# Altium schematic sheet [05] - HW_STATION_NODE.SchDoc
size A3; SheetNumber: 6; SheetTotal: 8
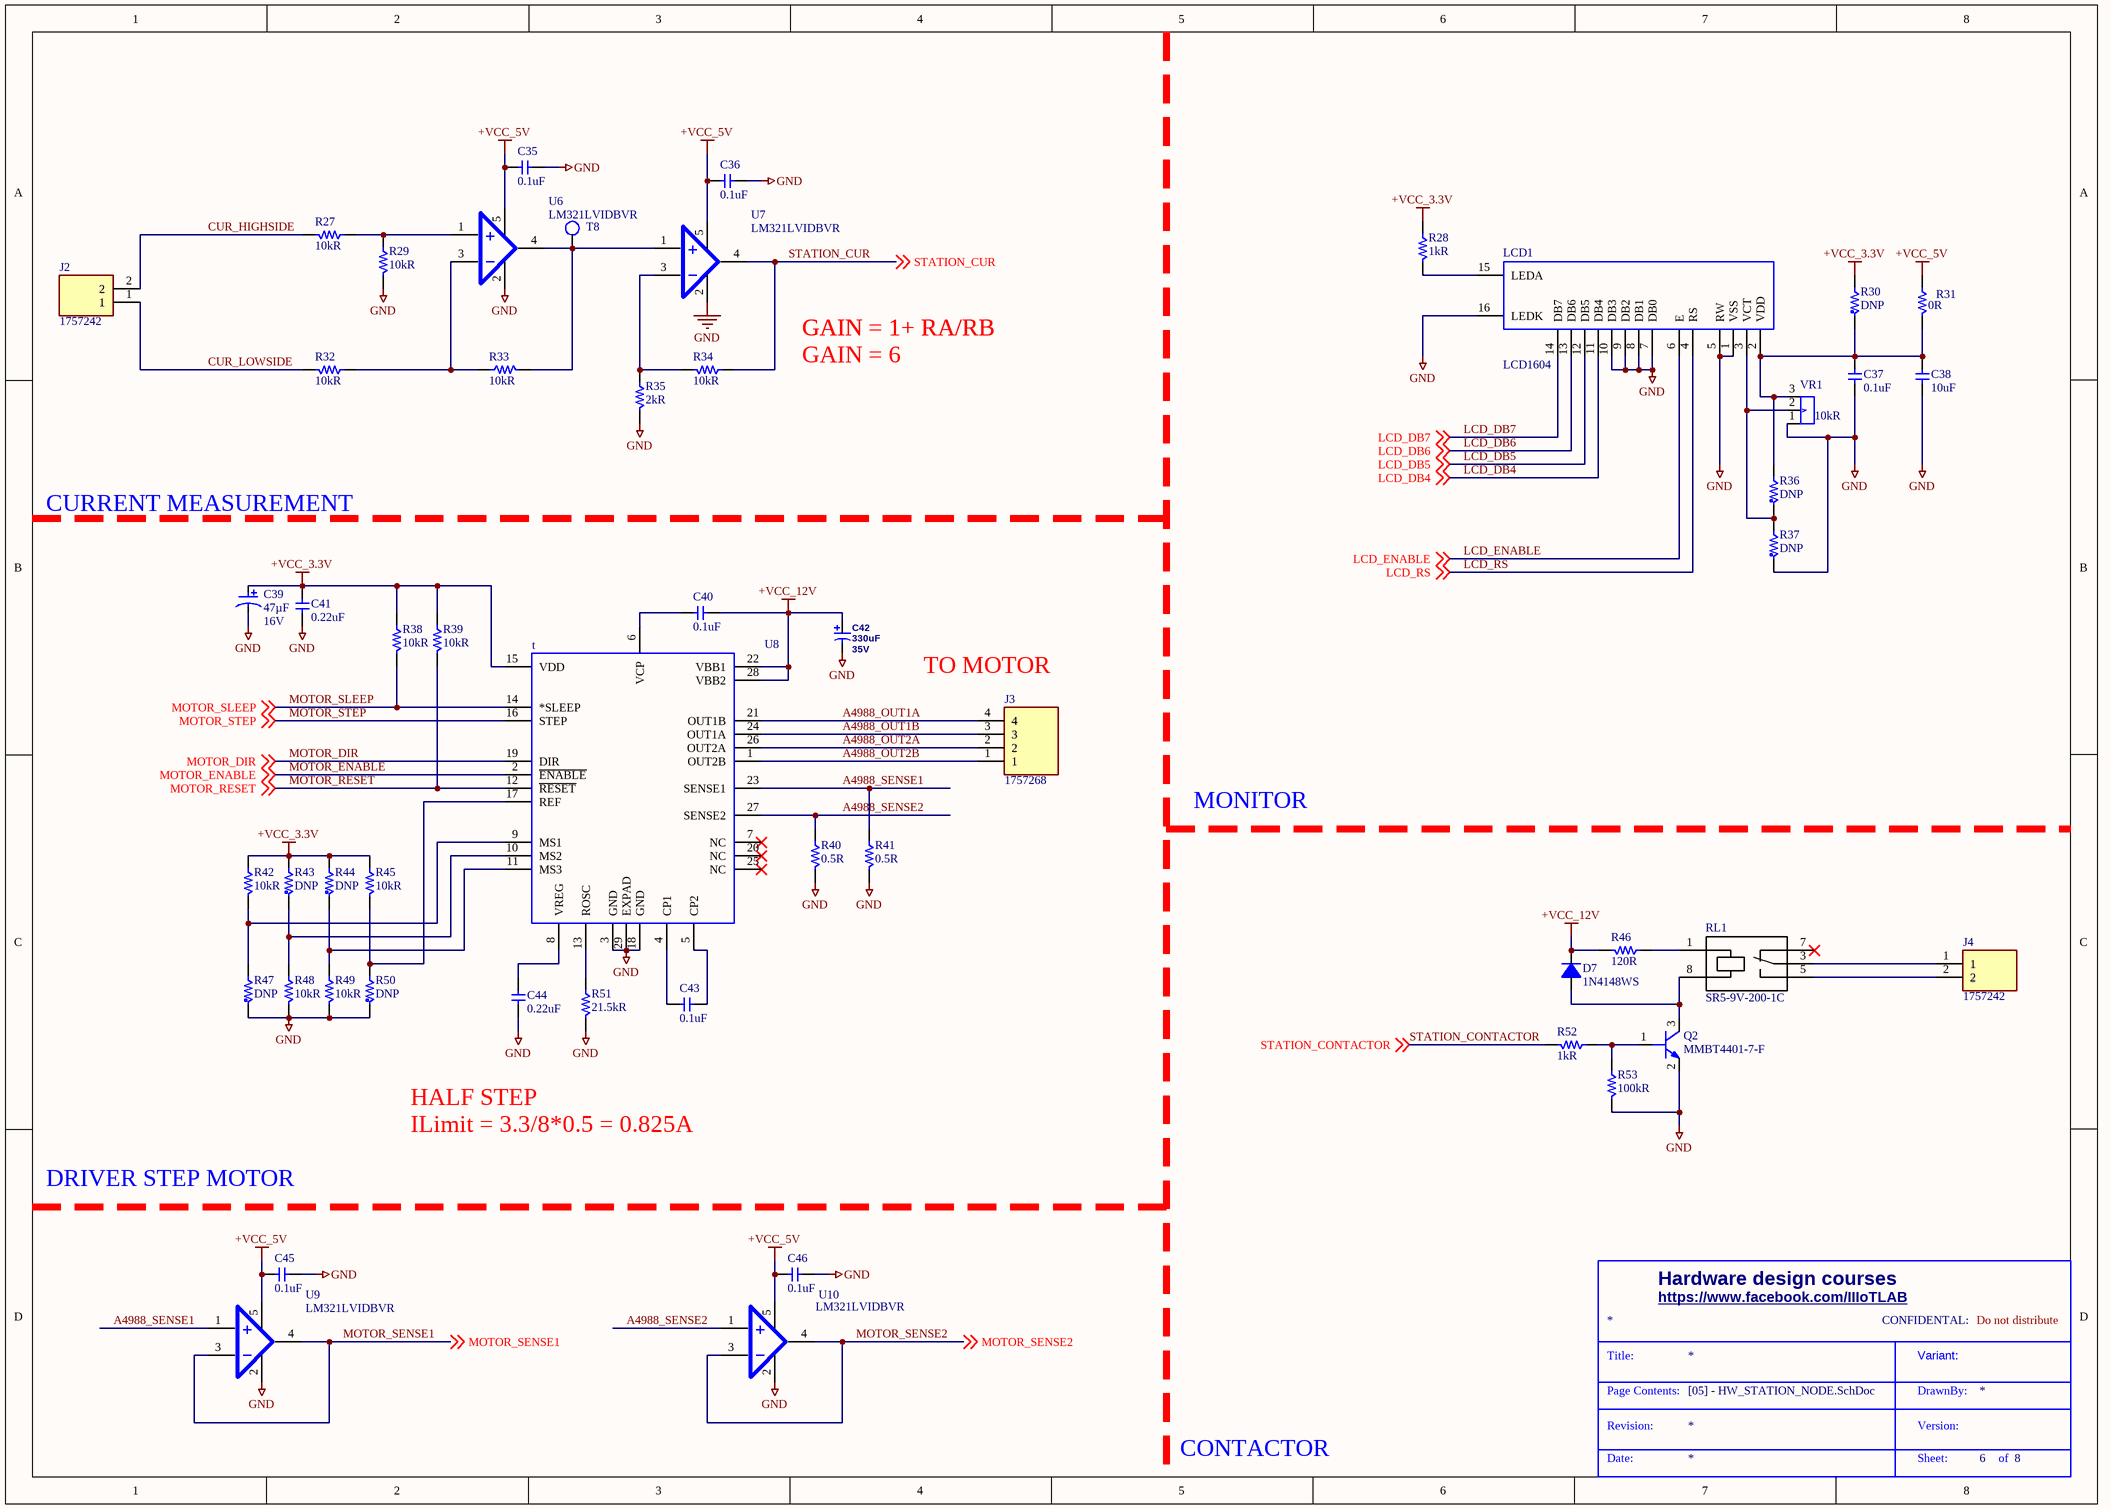
[diagram p0: [05] - HW_STATION_NODE.SchDoc]

## Parts
C35  0.1uF  [CAP 0402 (1005)]
C36  0.1uF  [CAP 0402 (1005)]
C37  0.1uF  [CAP 0402 (1005)]
C38  10uF  [CAP 0603 (1608)]
C39  Capacitance: 47µF  Voltage - Rated: 16V  [CAP TANTA 2312]  (hidden comment: TAJC476M016RNJ)
C40  0.1uF  [CAP 0402 (1005)]
C41  0.22uF  [CAP 0402 (1005)]
C42  330uF  Voltage Rating: 35V  [P-CAPAE116103X125M]
C43  0.1uF  [CAP 0402 (1005)]
C44  0.22uF  [CAP 0402 (1005)]
C45  0.1uF  [CAP 0402 (1005)]
C46  0.1uF  [CAP 0402 (1005)]
D7  1N4148WS  [SOD323]
J2  1757242  [1757242]
J3  1757268  [1757268]
J4  1757242  [1757242]
LCD1  LCD1604  [LCD 1604]
Q2  MMBT4401-7-F  [SOT-23-3]
R27  10kR  [RES 0402 (1005)]
R28  1kR  [RES 0402 (1005)]
R29  10kR  [RES 0402 (1005)]
R30  DNP  [RES 0603 (1608)]
R31  0R  [RES 0603 (1608)]
R32  10kR  [RES 0402 (1005)]
R33  10kR  [RES 0402 (1005)]
R34  10kR  [RES 0402 (1005)]
R35  2kR  [RES 0402 (1005)]
R36  DNP  [RES 0402 (1005)]
R37  DNP  [RES 0402 (1005)]
R38  10kR  [RES 0402 (1005)]
R39  10kR  [RES 0402 (1005)]
R40  0.5R  [RES 2512]
R41  0.5R  [RES 2512]
R42  10kR  [RES 0402 (1005)]
R43  DNP  [RES 0402 (1005)]
R44  DNP  [RES 0402 (1005)]
R45  10kR  [RES 0402 (1005)]
R46  120R  [RES 0603 (1608)]
R47  DNP  [RES 0402 (1005)]
R48  10kR  [RES 0402 (1005)]
R49  10kR  [RES 0402 (1005)]
R50  DNP  [RES 0402 (1005)]
R51  21.5kR  [RES 0402 (1005)]
R52  1kR  [RES 0402 (1005)]
R53  100kR  [RES 0402 (1005)]
RL1  SR5-9V-200-1C  [RELAY SR5-9V-200-1C]
T8  TEST_POINT  [TEST POINT]  (value not drawn)
U6  LM321LVIDBVR  [SOT-23-5]
U7  LM321LVIDBVR  [SOT-23-5]
U8  t  [28-VFQFN Exposed Pad]
U9  LM321LVIDBVR  [SOT-23-5]
U10  LM321LVIDBVR  [SOT-23-5]
VR1  10kR  [3296W-1]

## Nets
+VCC_3.3V: C39.2(+) C41.1 R28.2 R30.2 R38.2 R39.2 R42.2 R43.2 R44.2 R45.2 U8.15(VDD)
+VCC_5V: C35.2 C36.2 C45.2 C46.2 R31.2 U6.5 U7.5 U9.5 U10.5
+VCC_12V: C40.1 C42.1(+) D7.1(K) R46.1 U8.22(VBB1) U8.28(VBB2)
GND: C35.1 C36.1 C37.2 C38.2 C39.1(-) C41.2 C42.2(-) C44.2 C45.1 C46.1 LCD1.1(VSS) LCD1.5(RW) LCD1.7(DB0) LCD1.8(DB1) LCD1.9(DB2) LCD1.10(DB3) LCD1.16(LEDK) Q2.2(E) R29.1 R35.1 R37.1 R40.1 R41.1 R47.1 R48.1 R49.1 R50.1 R51.1 R53.1 U6.2 U7.2 U8.3(GND) U8.18(GND) U8.29(EXPAD) U9.2 U10.2 VR1.1(CCW)
A4988_OUT1A: J3.4 U8.21(OUT1B)
A4988_OUT1B: J3.3 U8.24(OUT1A)
A4988_OUT2A: J3.2 U8.26(OUT2A)
A4988_OUT2B: J3.1 U8.1(OUT2B)
A4988_SENSE1: R41.2 U8.23(SENSE1) U9.1
A4988_SENSE2: R40.2 U8.27(SENSE2) U10.1
CUR_HIGHSIDE: J2.2 R27.1
CUR_LOWSIDE: J2.1 R32.1
LCD_DB4: LCD1.11(DB4) ; off-sheet LCD_DB4
LCD_DB5: LCD1.12(DB5) ; off-sheet LCD_DB5
LCD_DB6: LCD1.13(DB6) ; off-sheet LCD_DB6
LCD_DB7: LCD1.14(DB7) ; off-sheet LCD_DB7
LCD_ENABLE: LCD1.6(E) ; off-sheet LCD_ENABLE
LCD_RS: LCD1.4(RS) ; off-sheet LCD_RS
MOTOR_DIR: U8.19(DIR) ; off-sheet MOTOR_DIR
MOTOR_ENABLE: U8.2(~{ENABLE}) ; off-sheet MOTOR_ENABLE
MOTOR_RESET: R39.1 U8.12(~{RESET}) ; off-sheet MOTOR_RESET
MOTOR_SENSE1: U9.3 U9.4 ; off-sheet MOTOR_SENSE1
MOTOR_SENSE2: U10.3 U10.4 ; off-sheet MOTOR_SENSE2
MOTOR_SLEEP: R38.1 U8.14(*SLEEP) ; off-sheet MOTOR_SLEEP
MOTOR_STEP: U8.16(STEP) ; off-sheet MOTOR_STEP
STATION_CONTACTOR: R52.1 ; off-sheet STATION_CONTACTOR
STATION_CUR: R34.2 U7.4 ; off-sheet STATION_CUR
NetC37_1: C37.1 C38.1 LCD1.2(VDD) R30.1 R31.1 R36.2 VR1.3(CW)
NetC40_2: C40.2 U8.6(VCP)
NetC43_1: C43.1 U8.5(CP2)
NetC43_2: C43.2 U8.4(CP1)
NetC44_1: C44.1 U8.8(VREG)
NetD7_2: D7.2(A) Q2.3(C) RL1.8(C2)
NetJ4_1: J4.1 RL1.3(C)
NetJ4_2: J4.2 RL1.5(NO)
NetLCD1_3: LCD1.3(VCT) R36.1 R37.2 VR1.2(WIPER)
NetLCD1_15: LCD1.15(LEDA) R28.1
NetQ2_1: Q2.1(B) R52.2 R53.2
NetR27_2: R27.2 R29.2 U6.1
NetR32_2: R32.2 R33.2 U6.3
NetR33_1: R33.1 T8.1 U6.4 U7.1
NetR34_1: R34.1 R35.2 U7.3
NetR42_1: R42.1 R47.2 U8.9(MS1)
NetR43_1: R43.1 R48.2 U8.10(MS2)
NetR44_1: R44.1 R49.2 U8.11(MS3)
NetR45_1: R45.1 R50.2 U8.17(REF)
NetR46_2: R46.2 RL1.1(C1)
NetR51_2: R51.2 U8.13(ROSC)

Not connected (* = marked no-connect by the designer): RL1 7(NC)*; U8 7(NC)* 20(NC)* 25(NC)*

## Notes on the sheet
- GAIN = 1+ RA/RB
- GAIN = 6
- CURRENT MEASUREMENT
- (near J3) TO MOTOR
- MONITOR
- HALF STEP
- DRIVER STEP MOTOR
- ILimit = 3.3/8*0.5 = 0.825A
- Hardware design courses
- https://www.facebook.com/IIIoTLAB
- CONFIDENTAL:
- Do not distribute
- Title:
- Page Contents:
- Variant:
- DrawnBy:
- CONTACTOR
- Revision:
- Date:
- Sheet:
- Version:
- of

## Library data of the parts
C35-C37 C40 C43 C45 C46 = CAP0402 0.1uF 50V: 50V 100nF ±10% 0402 Multilayer Ceramic Capacitors MLCC - SMD/SMT ROHS; Manufacturer: Samwha Capacitor; Manufacturer Part Number: CS1005X7R104K500NR; Supplier: LCSC electronics; Unit Price: $0.0017
C38 = CAP0603 10uF 25V: 25V 10uF X5R ±20% 0603 Multilayer Ceramic Capacitors MLCC - SMD/SMT ROHS; Manufacturer: Chinocera; Manufacturer Part Number: HGC0603R5106M250NTHJ; Supplier: LCSC electronics; Unit Price: $0.0199
C39 = CAP TANTA 47UF 16V 2312 20%: Manufacturer: AVX Corporation; Manufacturer Size Code: C; Type: Molded; ESR (Equivalent Series Resistance): 500 mOhm; Supplier 1: Digi-Key; Supplier Part Number 1: 478-3912-1-ND; Manufacturer Part Number: TAJC476M016RNJ; RoHS: RoHS Compliant; Category: Capacitors; Stock 1: 1330; Pricing 1: 1=0.96, 10=0.728, 25=0.644, 50=0.6048, 100=0.5208, 250=0.4704 (USD); Packaging: Cut Tape (CT); Part Status: Active; Tolerance: ±20%; Operating Temperature: -55°C ~ 125°C; Lifetime @ Temp.: -; Mounting Type: Surface Mount; Package / Case: 2312 (6032 Metric); Size / Dimension: 0.236" L x 0.126" W (6.00mm x 3.20mm); Height - Seated (Max): 0.110" (2.80mm); Lead Spacing: -; Features: General Purpose; Failure Rate: -; ComponentLink1URL: http://datasheets.avx.com/TAJ.pdf; ComponentLink1Description: http://datasheets.avx.com/TAJ.pdf
C41 C44 = CAP0402 0.22uF 35V: 35V 0.22uF X5R ±10% 0402 Multilayer Ceramic Capacitors MLCC - SMD/SMT ROHS; Manufacturer: Murata Electronics; Manufacturer Part Number: GRT155R6YA224KE01D; Supplier: LCSC electronics; Unit Price: US$ 0.0130
C42 = CAP ALUM 330uF 35V: CAP ALUM 330UF 20% 35V SMD; Manufacturer: Panasonic Electronic Components; Manufacturer Part Number: EEE-HA1V331P; Capacitance: 330µF; Lifetime @ Temp.: 1000 Hrs @ 105°C; Polarization: Polar; Ripple Current - Low Frequency: 250mA @ 120Hz; Ripple Current - High Frequency: 425mA @ 10kHz; Surface Mount Land Size: 0.406" L x 0.406" W (10.30mm x 10.30mm); Supplier 1: Digi-Key; RoHS: RoHS Compliant; Category: Capacitors; Stock 1: 134724; Pricing 1: 1=0.66, 10=0.486, 100=0.3336 (USD); Packaging: Cut Tape (CT); Part Status: Active; Tolerance: ±20%; ESR (Equivalent Series Resistance): -; Operating Temperature: -40°C ~ 105°C; Applications: Automotive; Impedance: -; Lead Spacing: -; Size / Dimension: 0.394" Dia (10.00mm); Height - Seated (Max): 0.402" (10.20mm); Mounting Type: Surface Mount; Package / Case: Radial, Can - SMD; ComponentLink1URL: https://industrial.panasonic.com/cdbs/www-data/pdf/RDE0000/ABA0000C1151.pdf; ComponentLink1Description: https://industrial.panasonic.com/cdbs/www-data/pdf/RDE0000/ABA0000C1151.pdf; Supplier Part Number 1: PCE4245CT-ND
D7 = DIO 1N4148WS: DIODE GEN PURP 75V 150MA SOD323F; Manufacturer: Fairchild/ON Semiconductor; Diode Type: Standard; Voltage - Forward (Vf) (Max) @ If: 1V @ 10mA; Speed: Small Signal =< 200mA (Io), Any Speed; Current - Reverse Leakage @ Vr: 5µA @ 75V; Capacitance @ Vr, F: 4pF @ 0V, 1MHz; Supplier 1: Digi-Key; Manufacturer Part Number: 1N4148WS; RoHS: RoHS Compliant; Category: Discrete Semiconductor Products; Stock 1: 318953; Pricing 1: 1=0.18, 10=0.168, 100=0.0912, 500=0.05614, 1000=0.03827 (USD); Packaging: Cut Tape (CT); Part Status: Active; Current - Average Rectified (Io): 150mA; Mounting Type: Surface Mount; Package / Case: SC-90, SOD-323F; Supplier Device Package: SOD-323F; Operating Temperature - Junction: 150°C (Max); ComponentLink1URL: https://www.fairchildsemi.com/datasheets/1N/1N4148WS.pdf; ComponentLink1Description: https://www.fairchildsemi.com/datasheets/1N/1N4148WS.pdf; Supplier Part Number 1: 1N4148WSFSCT-ND
J2 J4 = 1757242: Connector; Manufacturer_Name: Phoenix Contact; Datasheet Link: http://www.phoenixcontact.com/de/produkte/1757242/pdf; Height: 8.72mm; Manufacturer_Part_Number: 1757242; Mouser Part Number: 651-1757242; Mouser Price/Stock: https://www.mouser.co.uk/ProductDetail/Phoenix-Contact/1757242?qs=uD%2FdkN7XIa3Ejiz9qDxlzw%3D%3D; Arrow Part Number: 1757242; Arrow Price/Stock: https://www.arrow.com/en/products/1757242/phoenix-contact?region=nac
J3 = 1757268: Connector; Manufacturer_Name: Phoenix Contact; Datasheet Link: http://www.phoenixcontact.com/de/produkte/1757268/pdf; Height: 8.72mm; Manufacturer_Part_Number: 1757268; Mouser Part Number: 651-1757268; Mouser Price/Stock: https://www.mouser.co.uk/ProductDetail/Phoenix-Contact/1757268?qs=uD%2FdkN7XIa2BicmSj3mD7g%3D%3D; Arrow Part Number: 1757268; Arrow Price/Stock: https://www.arrow.com/en/products/1757268/phoenix-contact?region=nac
LCD1 = LCD 1604
Q2 = TRANS MMBT4401-7-F: TRANS NPN 40V 0.6A SMD SOT23-3; Manufacturer: Diodes Incorporated; Vce Saturation (Max) @ Ib, Ic: 750mV @ 50mA, 500mA; DC Current Gain (hFE) (Min) @ Ic, Vce: 100 @ 150mA, 1V; Frequency - Transition: 250MHz; Supplier 1: Digi-Key; Manufacturer Part Number: MMBT4401-7-F; RoHS: RoHS Compliant; Category: Discrete Semiconductor Products; Stock 1: 86548; Pricing 1: 1=0.15, 10=0.134, 100=0.0729, 500=0.04486, 1000=0.03059 (USD); Packaging: Cut Tape (CT); Part Status: Active; Transistor Type: NPN; Current - Collector Cutoff (Max): -; Operating Temperature: -55°C ~ 150°C (TJ); Mounting Type: Surface Mount; Package / Case: TO-236-3, SC-59, SOT-23-3; Supplier Device Package: SOT-23-3; ComponentLink1URL: https://www.diodes.com/assets/Datasheets/ds30039.pdf; ComponentLink1Description: https://www.diodes.com/assets/Datasheets/ds30039.pdf; Supplier Part Number 1: MMBT4401-FDICT-ND
R27 R29 R32-R34 R38 R39 R42 R45 R48 R49 = RES0402 10kR 1%: ±1% 10kΩ 0402 Chip Resistor - Surface Mount ROHS; Manufacturer: VO; Manufacturer Part Number: SCR0402F10K; Supplier: LCSC electronics; Unit Price: $0.0005
R28 R52 = RES0402 1kR 1%: ±5% 1kΩ 0402 Chip Resistor - Surface Mount ROHS; Manufacturer: VO; Manufacturer Part Number: SCR0402J1K; Supplier: LCSC electronics; Unit Price: $0.0004
R30 = RES0603 DNP: Res do not populate
R31 = RES0603 0R: 0Ω 0603 Chip Resistor - Surface Mount ROHS; Manufacturer: KOA Speer Elec; Manufacturer Part Number: RK73Z1JTTD; Supplier: LCSC electronics; Unit Price: $0.0048
R35 = RES0402 2kR 1%: ±1% 2kΩ 0402 Chip Resistor - Surface Mount ROHS; Manufacturer: VO; Manufacturer Part Number: SCR0402F2K; Supplier: LCSC electronics; Unit Price: $0.0005
R36 R37 R43 R44 R47 R50 = RES0402 DNP: Res do not populate
R40 R41 = R2512 0.5R 1% 2W: RES 0.5 OHM 1% 2W 2512; Manufacturer: Stackpole Electronics; Manufacturer Part Number: CSR2512FTR500; Categories: Resistors; Resistance: 500 mOhms; Temperature Coefficient: ±200ppm/°C; Supplier 1: Digi-Key; Stock 1: 61575; Pricing 1: 1=0.55, 10=0.418, 25=0.318, 50=0.2364, 100=0.1757, 250=0.1485, 500=0.1273, 1000=0.097 (USD); Series: CSR; Packaging: Tape & Reel (TR); Part Status: Active; Tolerance: ±1%; Power (Watts): 2W; Composition: Thick Film; Features: Current Sense; Operating Temperature: -55°C ~ 155°C; Package / Case: 2512 (6432 Metric); Supplier Device Package: 2512; Size / Dimension: 0.252 L x 0.126 W (6.40mm x 3.20mm); Height - Seated (Max): 0.026 (0.65mm); Number of Terminations: 2; Failure Rate: -; ComponentLink1URL: https://www.seielect.com/Catalog/SEI-CSR_CSRN.pdf?src-supplier=Avnet; ComponentLink1Description: https://www.seielect.com/Catalog/SEI-CSR_CSRN.pdf?src-supplier=Avnet; ComponentLink2URL: http://www.seielect.com/Catalog/SEI-csr.pdf?src-supplier=Future+Electronics; ComponentLink2Description: http://www.seielect.com/Catalog/SEI-csr.pdf?src-supplier=Future+Electronics; ComponentLink3URL: https://www.seielect.com/catalog/SEI-Packaging.pdf?src-supplier=Digi-Key; ComponentLink3Description: https://www.seielect.com/catalog/SEI-Packaging.pdf?src-supplier=Digi-Key; ComponentLink4URL: https://www.seielect.com/catalog/sei-csr_csrn.pdf?src-supplier=Digi-Key; ComponentLink4Description: https://www.seielect.com/catalog/sei-csr_csrn.pdf?src-supplier=Digi-Key; Supplier Part Number 1: CSR2512FTR500CT-ND
R46 = RES0603 120R 1%: ±1% 120Ω 0603 Chip Resistor - Surface Mount ROHS; Manufacturer: VO; Manufacturer Part Number: SCR0603F120R; Supplier: LCSC electronics; Unit Price: $0.0009
R51 = RES0402 21.5kR 1%: 62.5mW ±1% 21.5kΩ 0402 Chip Resistor - Surface Mount ROHS; Manufacturer: TyoHM; Manufacturer Part Number: RMC040221.5K1%N; Supplier: LCSC electronics; Unit Price: $0.0022
R53 = RES0402 100kR 1%: ±1% 100kΩ 0402 Chip Resistor - Surface Mount ROHS; Manufacturer: VO; Manufacturer Part Number: SCR0402F100K; Supplier: LCSC electronics; Unit Price: $0.0005
RL1 = RELAY 1 FORM C SR5-9V-200-1C: 15.6 X 10.6 X 11.8 MM, 9 V, 1 A,; Manufacturer: CUI Devices; Supplier 1: Digi-Key; Manufacturer Part Number: SR5-9V-200-1C; Stock 1: 985; Pricing 1: 1=1.3, 10=1.218, 25=1.0824, 50=1.0282, 100=0.9742, 250=0.8659, 450=0.8118, 950=0.7577, 9800=0.7198 (USD); Supplier Part Number 1: 2223-SR5-9V-200-1C-ND
U6 U7 U9 U10 = IC OPAM LM321LVIDBVR: IC OPAMP GP 1 CIRCUIT SOT23-5; Manufacturer: Texas Instruments; Alternative MPN: LK_13449; Supplier 1: Digi-Key; Manufacturer Part Number: LM321LVIDBVR; Stock 1: 22892; Pricing 1: 1=0.4, 10=0.304, 25=0.274, 100=0.1894, 250=0.1594, 500=0.1296, 1000=0.0997 (USD); ComponentLink1URL: http://www.ti.com/general/docs/suppproductinfo.tsp?distId=10&amp;gotoUrl=http%3A%2F%2Fwww.ti.com%2Flit%2Fgpn%2Flm321lv&src-supplier=Digi-Key; ComponentLink1Description: http://www.ti.com/general/docs/suppproductinfo.tsp?distId=10&amp;gotoUrl=http%3A%2F%2Fwww.ti.com%2Flit%2Fgpn%2Flm321lv&src-supplier=Digi-Key; Supplier Part Number 1: 296-51261-1-ND
U8 = IC A4988SETTR-T: IC MTR DRVR BIPOLAR 3-5.5V 28QFN; Manufacturer: Allegro MicroSystems; Alternative MPN: TL_05566; Operating Current: 4mA; Motor Controller Type: DMOS Stepping Motor Driver; Operating Supply Voltage (Min): 8V; Operating Supply Voltage (Max): 35V; Supplier 1: Mouser; Manufacturer Part Number: A4988SETTR-T; Stock 1: 15161; Pricing 1: 1=3.26, 10=2.94, 25=2.78, 50=2.78, 100=2.41, 250=2.29, 1000=1.93, 10000=1.71 (USD); Operating Temperature Classification: Commercial; Package Type: QFN EP; Packaging: Tape and Reel; ComponentLink1URL: http://www.farnell.com/datasheets/2354165.pdf?src-supplier=Element14; ComponentLink1Description: http://www.farnell.com/datasheets/2354165.pdf?src-supplier=Element14; ComponentLink2URL: http://www.farnell.com/datasheets/2354165.pdf?src-supplier=Newark; ComponentLink2Description: http://www.farnell.com/datasheets/2354165.pdf?src-supplier=Newark; ComponentLink3URL: http://www.allegromicro.com/en/Products/Motor-Driver-And-Interface-ICs/Bipolar-Stepper-Motor-Drivers/~/media/Files/Datasheets/A4988-Datasheet.ashx?src-supplier=Avnet; ComponentLink3Description: http://www.allegromicro.com/en/Products/Motor-Driver-And-Interface-ICs/Bipolar-Stepper-Motor-Drivers/~/media/Files/Datasheets/A4988-Datasheet.ashx?src-supplier=Avnet; ComponentLink4URL: https://www.verical.com/server-webapp/html/getDatasheet?partID=557828&src-supplier=Verical; ComponentLink4Description: https://www.verical.com/server-webapp/html/getDatasheet?partID=557828&src-supplier=Verical; Supplier Part Number 1: 250-A4988SETTR-T
VR1 = 3296W-1-103RLF: TRIMMER 10K OHM 0.5W PC PIN TOP; Manufacturer_Name: Bourns; Datasheet Link: https://www.bourns.com/pdfs/3296.pdf; Manufacturer_Part_Number: 3296W-1-103RLF; Mouser Part Number: 652-3296W-1-103RLF; Mouser Price/Stock: https://www.mouser.co.uk/ProductDetail/Bourns/3296W-1-103RLF?qs=2bTIwLLrckTSiNyA4dRdUg%3D%3D; Arrow Part Number: 3296W-1-103RLF; Arrow Price/Stock: https://www.arrow.com/en/products/3296w-1-103rlf/bourns?region=nac